# Altium schematic sheet input_output.SchDoc: Input - Output
size A3; SheetNumber: 2; SheetTotal: 4
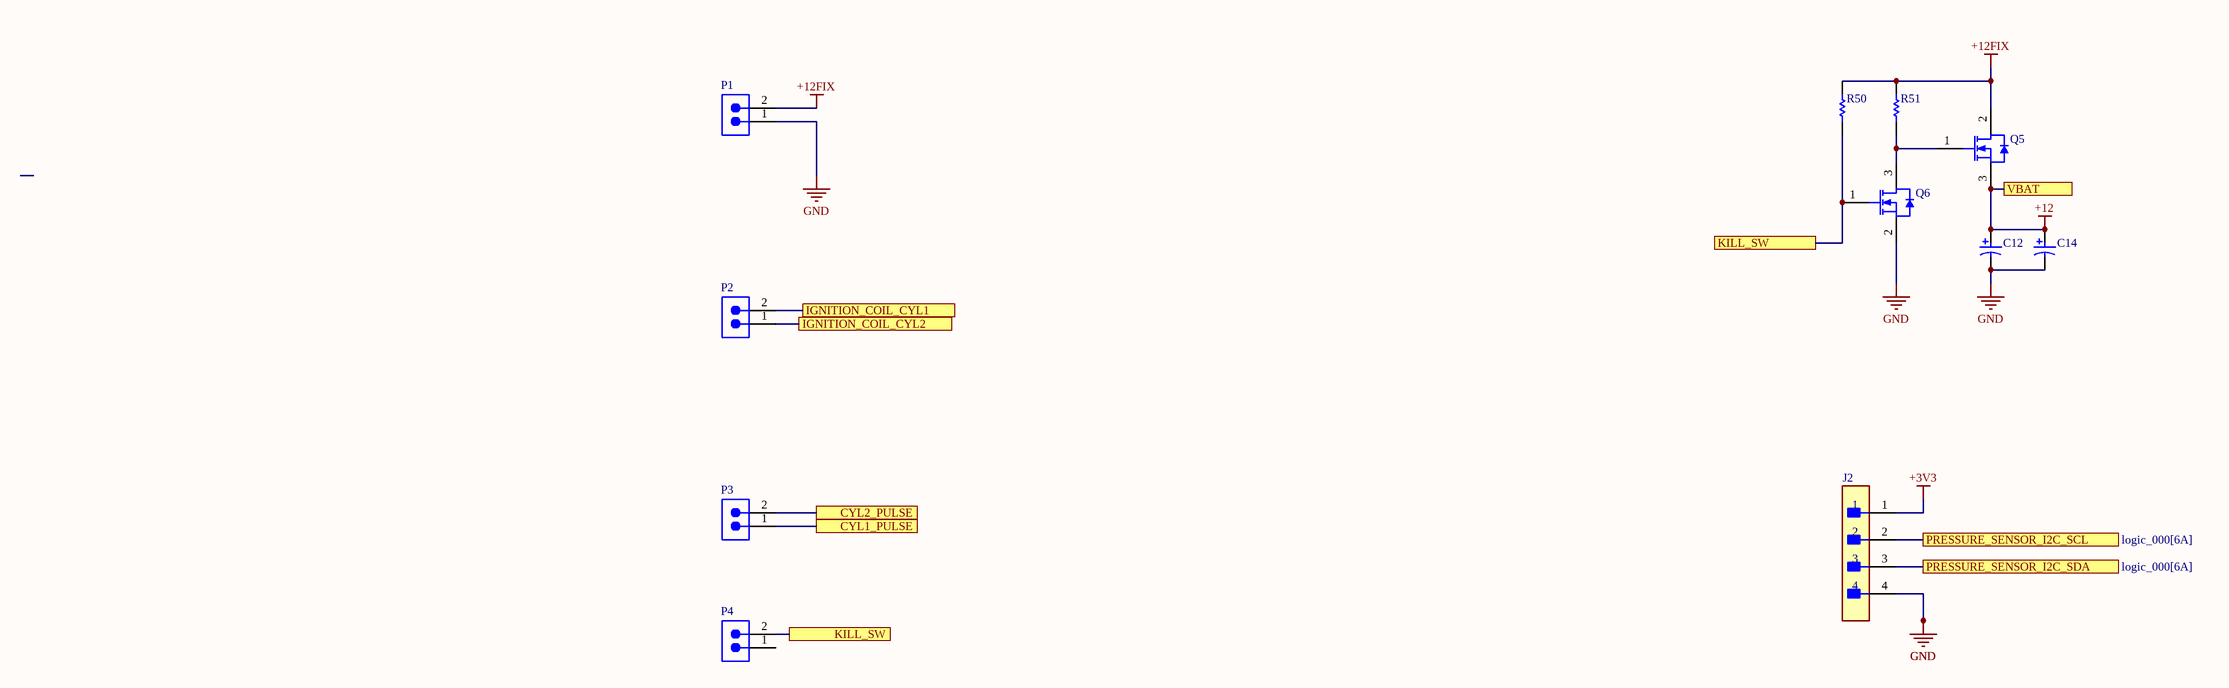
[diagram p0: input_output.SchDoc]

## Parts
C12  UUD1A102MNL1GS  [NIC-CAPA2-10X10_V]  (value not drawn)
C14  UUD1A102MNL1GS  [NIC-CAPA2-10X10_V]  (value not drawn)
J2  53047-0410  [FP-53047-0410-MFG]  (value not drawn)
P1  691701510002B  [691701510002B]  (value not drawn)
P2  691701510002B  [691701510002B]  (value not drawn)
P3  691701510002B  [691701510002B]  (value not drawn)
P4  691701510002B  [691701510002B]  (value not drawn)
Q5  IPD600N25N3  [INF-PG-TO252-3-11_A_L]  (value not drawn)
Q6  PMV56XN,215  [NXP-SOT23_L]  (value not drawn)
R50  RC0603FR-07470KL  [RESC1608X55X25ML10T15]  (value not drawn)
R51  RC0603FR-07470KL  [RESC1608X55X25ML10T15]  (value not drawn)

## Ports
CYL1_PULSE (see input_filter[3A]), CYL2_PULSE (see input_filter[3B]), IGNITION_COIL_CYL1 (see power_side[7A]), IGNITION_COIL_CYL2 (see power_side[7C]), KILL_SW (see input_output[2C]), KILL_SW (see input_output[6B]), PRESSURE_SENSOR_I2C_SCL (see logic_000[6A]), PRESSURE_SENSOR_I2C_SDA (see logic_000[6A]), VBAT (see logic_000[3C], power_side[2A], power_side[2C], power_side[5B])

## Nets
+3V3: J2.1
+12: C12.1 C14.1 Q5.3(SOURCE) ; port VBAT
+12FIX: P1.2 Q5.2(DRAIN) R50.2 R51.2
GND: C12.2 C14.2 J2.4 P1.1 Q6.2(S)
CYL1_PULSE: P3.1 ; port CYL1_PULSE
CYL2_PULSE: P3.2 ; port CYL2_PULSE
IGNITION_COIL_CYL1: P2.2 ; port IGNITION_COIL_CYL1
IGNITION_COIL_CYL2: P2.1 ; port IGNITION_COIL_CYL2
KILL_SW: P4.2 Q6.1(G) R50.1 ; port KILL_SW
PRESSURE_SENSOR_I2C_SCL: J2.2 ; port PRESSURE_SENSOR_I2C_SCL
PRESSURE_SENSOR_I2C_SDA: J2.3 ; port PRESSURE_SENSOR_I2C_SDA
NetQ5_1: Q5.1(GATE) Q6.3(D) R51.1

Not connected (* = marked no-connect by the designer): P4 1

## Library data of the parts
C12 C14 = CMP-0687-00006-1: Aluminum Electrolytic Capacitor, UD Series, Low Impedance, 1000 uF, 10 V, + / - 20%, -55 to 105 degC, Chip Type, 10 x 10 mm D x L, Pb-Free, Reel; Manufacturer: Nichicon; Rated Voltage: 10 V; Rated Capacitance: 1000 uF; Endurance Time: 5000 h; Impedance: 0.09 Ohm; Packing: Dia382mm Reel; Tolerance Rated Capacitance: -20 to 20%; Rated Ripple Current (at 100kHz): 670 mA; DatasheetVersion: 08/2012; PackageReference: CAPAE-D10H10; PackageDescription: 2-Pin Surface Mount Device, Diameter 10 mm, Height 10 mm, Pitch 8 mm; ComponentLink3URL: http://products.nichicon.co.jp/en/pdf/XJA043/e-ud.pdf; ComponentLink2Description: Datasheet; Diameter: 10 mm; ComponentLink1Description: Manufacturer URL; RoHS: TRUE; ComponentLink2URL: http://products.nichicon.co.jp/en/pdf/XJA043/e-ud.pdf; Length: 10 mm; ComponentLink1URL: http://www.nichicon.co.jp/; Mounting Technology: Surface Mount; PartNumber: UUD1A102MNL1GS; ComponentLink3Description: Package Specification
J2 = CMP-04776-000321-1: CONN HEADER VERT 4POS 1.25MM; Plating: Tin; Number of Positions: 4; Voltage Rating (AC): 125V; Insulation Resistance: 100MR; Current Rating: 1A; Glow Wire Compliant: Non-compliant; Contact Resistance: 20mR; Gender: Male; Series: PicoBlade; Contact Material: Bronze; Number of Circuits: 4; Voltage Rating (DC): 125V; Working Voltage: 125V; Termination: Solder; Pitch: 1.25mm; Housing Material: Polyamide; Orientation: Vertical; Current: 1A; Flammability Rating: UL94 V-0; Max Voltage Rating (AC): 125V; Housing Color: Natural; Package Quantity: 5000; Mount: Through Hole; Case/Package: 0410; Max Operating Temperature: 85°C; RoHS Compliant: Yes; Voltage Rating: 125V; Lead Free: Lead Free; Packaging: Tray; Color: Natural; Contact Plating: Tin; Number of Rows: 1; Radiation Hardening: No; Min Operating Temperature: -40°C; Voltage: 125V; Number of Contacts: 4
P1-P4 = CMP-1502-02329-2: NexarPartId: 22866752; Connector Type: Terminal Block; Current Rating: 10A; Voltage Rating: 300V; Number of Contacts: 2; Gender: Male; Pitch: 5.08mm; RoHS: Compliant; Contact Gender: Male; Lead Pitch: 5.08mm; Termination: PCB; Color: Black; Housing Material: Polymer; Length: 12.96mm; Mount: Through Hole; Contact Plating: Tin; Max Operating Temperature: 105°C; REACH SVHC: Unknown; Number of Pins: 2; Min Operating Temperature: -40°C; Contact Material: Brass
Q5 = CMP-1091-00172-1: N-Channel OptiMOS 3 Power-Transistor, 60 V VDS, 90 A ID, -55 to 175 degC, PG-TO252-3-11, Reel, Green; PartNumber: IPD035N06L3 G; Manufacturer: Infineon; RthJC (max): 0.9Â K/W; ID (max): 90Â A; RDS (on) (max): 3.5Â mOhm; VDS (max): 60Â V; VGS(th) (max): 2.2Â V; Polarity: N; RDS (on) (max) (@4.5V): 5.5Â mOhm; Ptot (max): 167Â W; RthJA (max): 62 K/W; QG: 59Â nC; VGS(th) (min): 1.2Â V; Green: TRUE; IDpuls (max): 360Â A; PackageVersion: Rev. 02, 03/2007; ComponentLink1URL: http://www.infineon.com/; Rth: 0.9Â K/W; ComponentLink2URL: http://www.infineon.com/dgdl/IPD035N06L3_Rev2.3.pdf?folderId=db3a304313b8b5a60113cee8763b02d7&fileId=db3a30431b3e89eb011b4558ed7f7d14; ComponentLink1Description: Manufacturer URL; DatasheetVersion: Rev. 2.3; ComponentLink2Description: Datasheet; Halogen-free: TRUE; PackageDescription: 3-Pin Plastic (Green) Transistor Single Outline Package, 6.57 x 6.1 mm Body, 2.29 mm Pitch; Mounting Technology: Surface Mount; Packing: Reel; PackageReference: PG-TO252-3-11; ComponentLink3Description: Package Specification; ComponentLink3URL: http://www.infineon.com/dgdl/IPD160N04L_rev1.0.pdf?folderId=db3a3043163797a6011643468e7505a4&fileId=db3a3043163797a60116436401cf05cf
Q6 = CMP-1258-00163-1: N-Channel uTrenchMOS(TM) Extremely Low Level FET, 20 V, 3.76 A, 3-Pin SOT23, Tape and Reel; Manufacturer: NXP Semiconductors; VDS [max] (V): 20; Channel Type: N; Packing: Tape & Reel; Coss [typ] (pF): 125; Ciss [typ] (pF): 230; ID [max] (A): 3.76; PartNumber: PMV56XN,215; Mounting Technology: Surface Mount; ComponentLink1Description: Manufacturer URL; DatasheetVersion: Rev. 02; ComponentLink2URL: http://www.nxp.com/documents/data_sheet/PMV56XN.pdf; PackageVersion: 06-03-16, 03/2006; PackageDescription: 3-Pin Small Outline Transistor Package, Body 2.9 x 1.3 mm, Pitch 0.95 mm; ComponentLink1URL: http://www.nxp.com/; Code_JEDEC: TO-236AB; ComponentLink3URL: http://www.nxp.com/documents/outline_drawing/sot023_po.pdf; PackageReference: SOT23; ComponentLink2Description: Datasheet; ComponentLink3Description: Package Specification
R50 R51 = CMP-1659-00049-1: Chip Resistor, 470 KOhm, +/- 1%, 0.1 W, -55 to 155 degC, 0603 (1608 Metric), RoHS, Tape and Reel; ComponentLink1Description: Manufacturer URL; ComponentLink2Description: Datasheet; ComponentLink2URL: http://www.yageo.com/documents/recent/PYu-RC_Group_51_RoHS_L_04.pdf; PackageReference: 0603; DatasheetVersion: Rev. 4, 02/2016; ComponentLink1URL: http://www.yageo.com/; PackageDescription: 2-Pin Surface Mount Device, Body 1.6 x 0.8 mm